# Altium schematic sheet PreAmplicationFilteringCircuit.SchDoc
size C
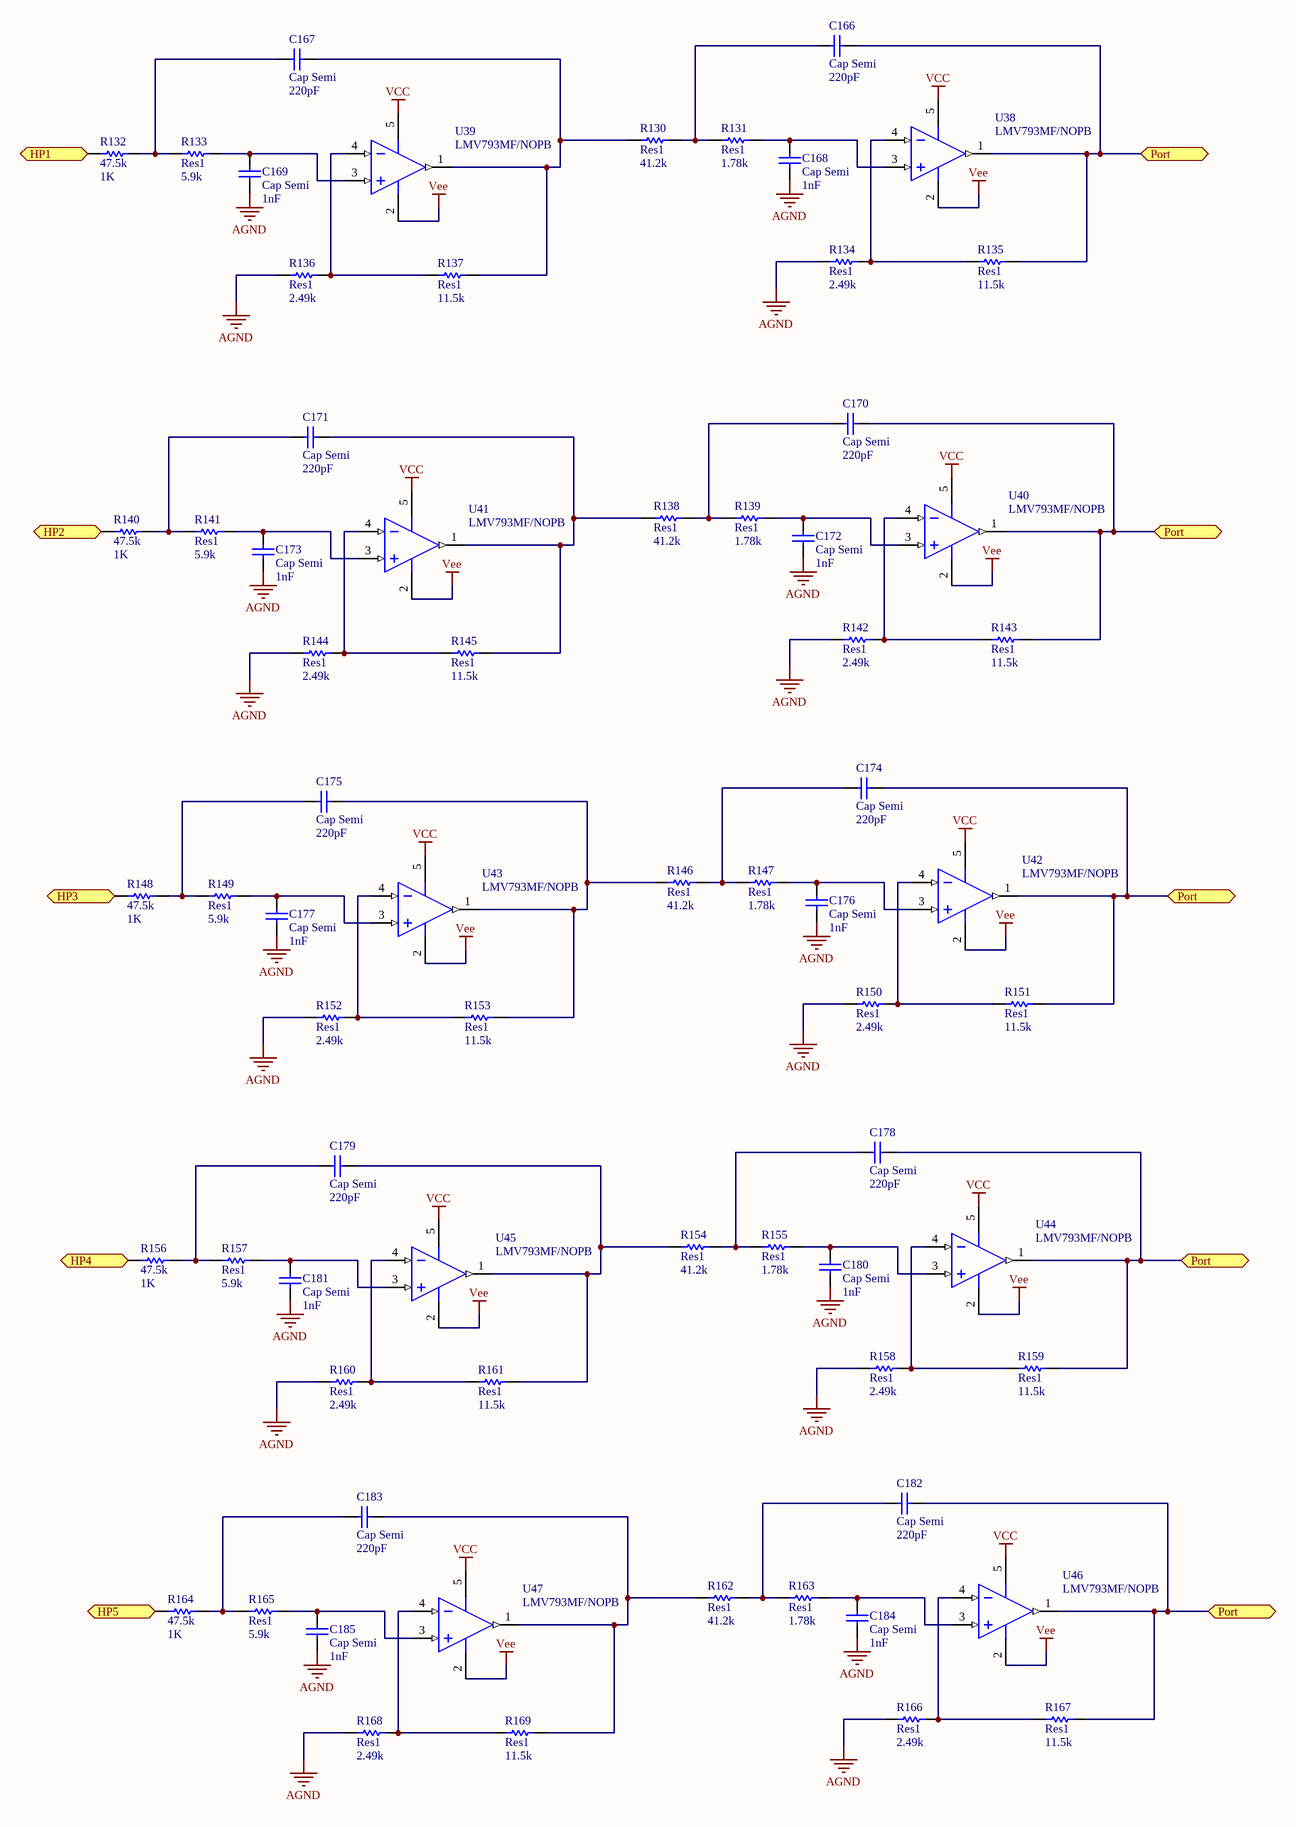
[diagram p0: PreAmplicationFilteringCircuit.SchDoc]

## Parts
C166  Cap Semi  value 220pF  [0402]
C167  Cap Semi  value 220pF  [0402]
C168  Cap Semi  value 1nF  [0402]
C169  Cap Semi  value 1nF  [0402]
C170  Cap Semi  value 220pF  [0402]
C171  Cap Semi  value 220pF  [0402]
C172  Cap Semi  value 1nF  [0402]
C173  Cap Semi  value 1nF  [0402]
C174  Cap Semi  value 220pF  [0402]
C175  Cap Semi  value 220pF  [0402]
C176  Cap Semi  value 1nF  [0402]
C177  Cap Semi  value 1nF  [0402]
C178  Cap Semi  value 220pF  [0402]
C179  Cap Semi  value 220pF  [0402]
C180  Cap Semi  value 1nF  [0402]
C181  Cap Semi  value 1nF  [0402]
C182  Cap Semi  value 220pF  [0402]
C183  Cap Semi  value 220pF  [0402]
C184  Cap Semi  value 1nF  [0402]
C185  Cap Semi  value 1nF  [0402]
R130  Res1  value 41.2k  [AXIAL-0.3]
R131  Res1  value 1.78k  [AXIAL-0.3]
R132  47.5k  value 1K  [AXIAL-0.3]
R133  Res1  value 5.9k  [AXIAL-0.3]
R134  Res1  value 2.49k  [AXIAL-0.3]
R135  Res1  value 11.5k  [AXIAL-0.3]
R136  Res1  value 2.49k  [AXIAL-0.3]
R137  Res1  value 11.5k  [AXIAL-0.3]
R138  Res1  value 41.2k  [AXIAL-0.3]
R139  Res1  value 1.78k  [AXIAL-0.3]
R140  47.5k  value 1K  [AXIAL-0.3]
R141  Res1  value 5.9k  [AXIAL-0.3]
R142  Res1  value 2.49k  [AXIAL-0.3]
R143  Res1  value 11.5k  [AXIAL-0.3]
R144  Res1  value 2.49k  [AXIAL-0.3]
R145  Res1  value 11.5k  [AXIAL-0.3]
R146  Res1  value 41.2k  [AXIAL-0.3]
R147  Res1  value 1.78k  [AXIAL-0.3]
R148  47.5k  value 1K  [AXIAL-0.3]
R149  Res1  value 5.9k  [AXIAL-0.3]
R150  Res1  value 2.49k  [AXIAL-0.3]
R151  Res1  value 11.5k  [AXIAL-0.3]
R152  Res1  value 2.49k  [AXIAL-0.3]
R153  Res1  value 11.5k  [AXIAL-0.3]
R154  Res1  value 41.2k  [AXIAL-0.3]
R155  Res1  value 1.78k  [AXIAL-0.3]
R156  47.5k  value 1K  [AXIAL-0.3]
R157  Res1  value 5.9k  [AXIAL-0.3]
R158  Res1  value 2.49k  [AXIAL-0.3]
R159  Res1  value 11.5k  [AXIAL-0.3]
R160  Res1  value 2.49k  [AXIAL-0.3]
R161  Res1  value 11.5k  [AXIAL-0.3]
R162  Res1  value 41.2k  [AXIAL-0.3]
R163  Res1  value 1.78k  [AXIAL-0.3]
R164  47.5k  value 1K  [AXIAL-0.3]
R165  Res1  value 5.9k  [AXIAL-0.3]
R166  Res1  value 2.49k  [AXIAL-0.3]
R167  Res1  value 11.5k  [AXIAL-0.3]
R168  Res1  value 2.49k  [AXIAL-0.3]
R169  Res1  value 11.5k  [AXIAL-0.3]
U38  LMV793MF/NOPB  [DBV0005A_N]
U39  LMV793MF/NOPB  [DBV0005A_N]
U40  LMV793MF/NOPB  [DBV0005A_N]
U41  LMV793MF/NOPB  [DBV0005A_N]
U42  LMV793MF/NOPB  [DBV0005A_N]
U43  LMV793MF/NOPB  [DBV0005A_N]
U44  LMV793MF/NOPB  [DBV0005A_N]
U45  LMV793MF/NOPB  [DBV0005A_N]
U46  LMV793MF/NOPB  [DBV0005A_N]
U47  LMV793MF/NOPB  [DBV0005A_N]

## Ports
HP1, HP2, HP3, HP4, HP5, Port

## Nets
AGND: C168.1 C169.1 C172.1 C173.1 C176.1 C177.1 C180.1 C181.1 C184.1 C185.1 R134.1 R136.1 R142.1 R144.1 R150.1 R152.1 R158.1 R160.1 R166.1 R168.1
VCC: U38.5(V+) U39.5(V+) U40.5(V+) U41.5(V+) U42.5(V+) U43.5(V+) U44.5(V+) U45.5(V+) U46.5(V+) U47.5(V+)
Vee: U38.2(V-) U39.2(V-) U40.2(V-) U41.2(V-) U42.2(V-) U43.2(V-) U44.2(V-) U45.2(V-) U46.2(V-) U47.2(V-)
HP1: R132.1 ; port HP1
HP2: R140.1 ; port HP2
HP3: R148.1 ; port HP3
HP4: R156.1 ; port HP4
HP5: R164.1 ; port HP5
Port: C166.2 C170.2 C174.2 C178.2 C182.2 R135.2 R143.2 R151.2 R159.2 R167.2 U38.1(OUT) U40.1(OUT) U42.1(OUT) U44.1(OUT) U46.1(OUT) ; port Port
NetC166_1: C166.1 R130.2 R131.1
NetC167_1: C167.1 R132.2 R133.1
NetC167_2: C167.2 R130.1 R137.2 U39.1(OUT)
NetC168_2: C168.2 R131.2 U38.3(IN+)
NetC169_2: C169.2 R133.2 U39.3(IN+)
NetC170_1: C170.1 R138.2 R139.1
NetC171_1: C171.1 R140.2 R141.1
NetC171_2: C171.2 R138.1 R145.2 U41.1(OUT)
NetC172_2: C172.2 R139.2 U40.3(IN+)
NetC173_2: C173.2 R141.2 U41.3(IN+)
NetC174_1: C174.1 R146.2 R147.1
NetC175_1: C175.1 R148.2 R149.1
NetC175_2: C175.2 R146.1 R153.2 U43.1(OUT)
NetC176_2: C176.2 R147.2 U42.3(IN+)
NetC177_2: C177.2 R149.2 U43.3(IN+)
NetC178_1: C178.1 R154.2 R155.1
NetC179_1: C179.1 R156.2 R157.1
NetC179_2: C179.2 R154.1 R161.2 U45.1(OUT)
NetC180_2: C180.2 R155.2 U44.3(IN+)
NetC181_2: C181.2 R157.2 U45.3(IN+)
NetC182_1: C182.1 R162.2 R163.1
NetC183_1: C183.1 R164.2 R165.1
NetC183_2: C183.2 R162.1 R169.2 U47.1(OUT)
NetC184_2: C184.2 R163.2 U46.3(IN+)
NetC185_2: C185.2 R165.2 U47.3(IN+)
NetR134_2: R134.2 R135.1 U38.4(IN-)
NetR136_2: R136.2 R137.1 U39.4(IN-)
NetR142_2: R142.2 R143.1 U40.4(IN-)
NetR144_2: R144.2 R145.1 U41.4(IN-)
NetR150_2: R150.2 R151.1 U42.4(IN-)
NetR152_2: R152.2 R153.1 U43.4(IN-)
NetR158_2: R158.2 R159.1 U44.4(IN-)
NetR160_2: R160.2 R161.1 U45.4(IN-)
NetR166_2: R166.2 R167.1 U46.4(IN-)
NetR168_2: R168.2 R169.1 U47.4(IN-)

## Library data of the parts
C166-C185 = Cap Semi: Capacitor (Semiconductor SIM Model); Published: 8-Jun-2000; LatestRevisionDate: 29-May-2009; LatestRevisionNote: IPC-7351 Footprint Added.; PackageReference: C1206; Publisher: Altium Limited; PackageDescription: Chip Capacitor
R130-R169 = Res1: Resistor; Published: 8-Jun-2000; LatestRevisionDate: 17-Jul-2002; LatestRevisionNote: Re-released for DXP Platform.; PackageReference: AXIAL-0.3; Publisher: Altium Limited; PackageDescription: Axial Device, Thru-Hole; 2 Leads; 0.3 in Pin Spacing
U38-U47 = CMP-0055-01161-3: 88 MHz, Low Noise, 1.8V CMOS Input, Decompensated Operational Amplifiers, 5-pin SOT-23, Pb-Free; Manufacturer: Texas Instruments; PowerWise: Y; PackageTopMarking: AS4A*XTT; Package Reference: DBV0005A; PackageDescription: Molded SOT-23, .115 x .063 x .040 in Body, 5 Lead, .0375 in Pitch; CompType: Amplifiers; ComponentLink1Description: Datasheet URL; PinCount: 5; RoHS: Y; ComponentLink1URL: http://www.ti.com/general/docs/lit/getliterature.tsp?genericPartNumber=LMV793&fileType=pdf